# Altium schematic sheet Discharge.SchDoc
size A4
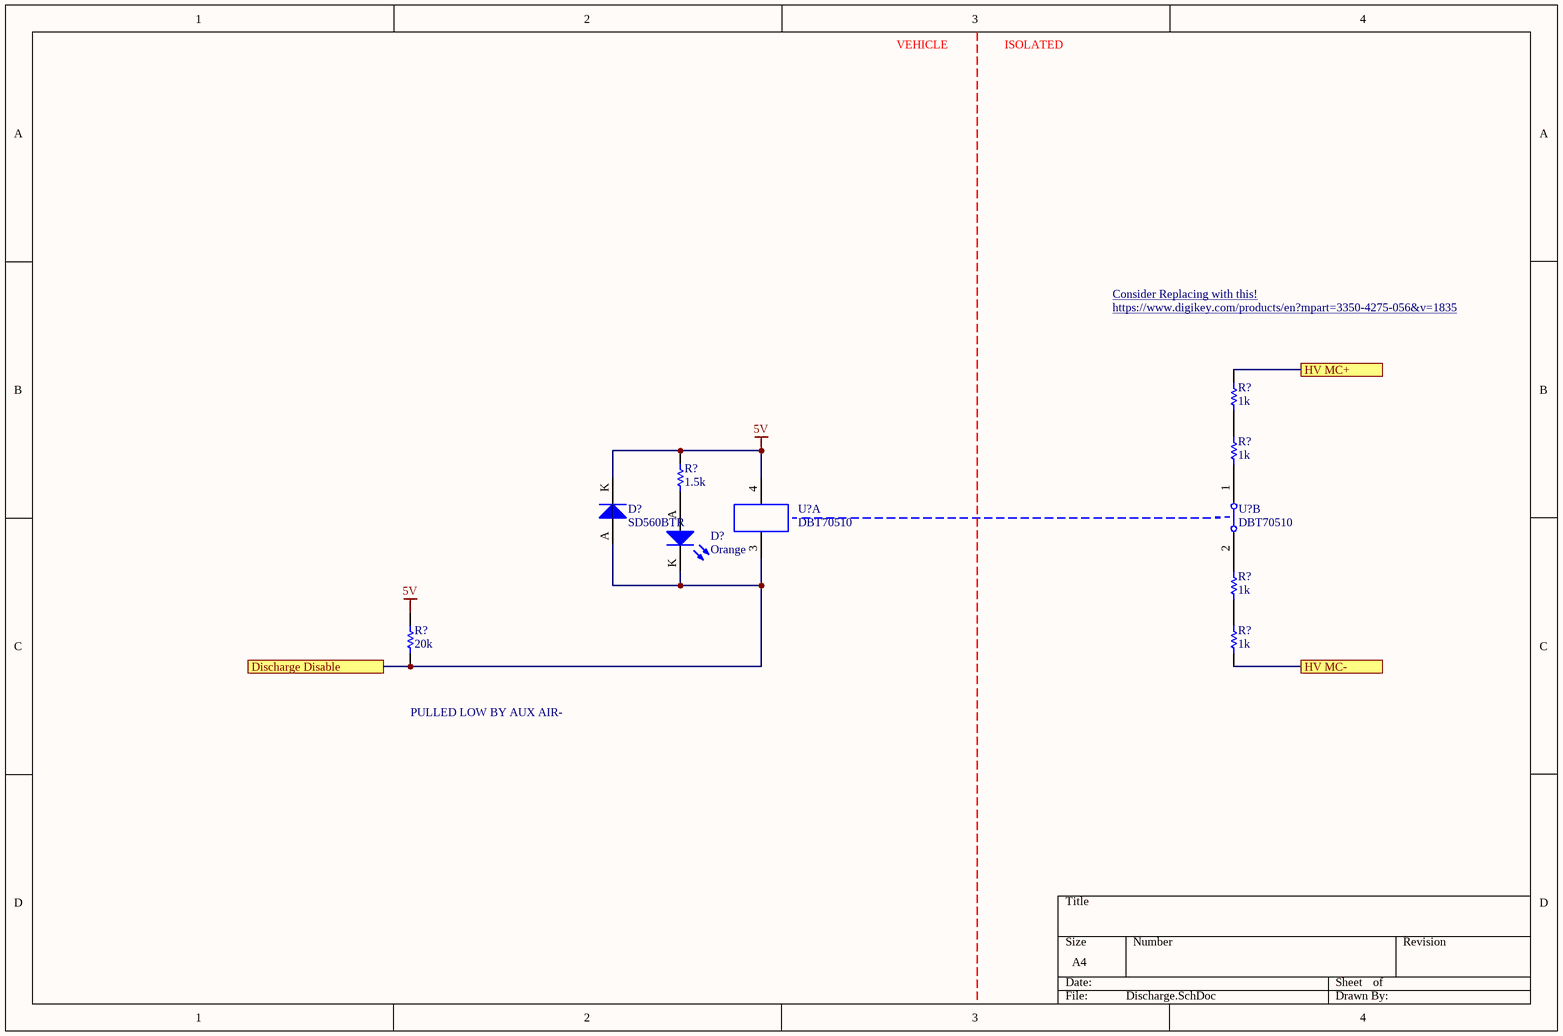
[diagram p0: Discharge.SchDoc]

## Parts
(Parts that share a designator on the sheet are numbered #1, #2 ... from top to bottom, then left to right.)
D?#1  Orange  [0805 LED]
D?#2  SD560BTR  [SMB Diode]
R?#1  1k  [B TO-263]
R?#2  1k  [B TO-263]
R?#3  1.5k  [0805]
R?#4  1k  [B TO-263]
R?#5  20k  [0805]
R?#6  1k  [B TO-263]
U?#1  DBT70510  [C3 SPST]  (part A of 2)
U?#2  DBT70510  [C3 SPST]  (part B of 2)

## Ports
Discharge Disable, HV MC+, HV MC-

## Nets
5V: D?#2.K R?#3.2 R?#5.2 U?#1.4
Discharge Disable: D?#1.K D?#2.A R?#5.1 U?#1.3 ; port Discharge Disable
HV MC+: R?#1.2 ; port HV MC+
HV MC-: R?#6.1 ; port HV MC-
NetD?#1_A: D?#1.A R?#3.1
NetR?#1_1: R?#1.1 R?#2.2
NetR?#4_1: R?#4.1 R?#6.2
NetR?#4_2: R?#4.2 U?#2.2

Not connected (* = marked no-connect by the designer): R?#2 1; U?#2 1

## Notes on the sheet
- VEHICLE
- ISOLATED
- https://www.digikey.com/products/en?mpart=3350-4275-056&v=1835
- Consider Replacing with this! <https://www.digikey.com/products/en?mpart=3350-4275-056&v=1835>
- PULLED LOW BY AUX AIR-

## Library data of the parts
D?#1 = SML-211DTT86: Orange LED Indication - Discrete 1.75V 0805 (2012 Metric); Manufacturer: ROHM Semiconductor; Part Number: SML-211DTT86; Colour: Orange; Digikey Part Number: 511-1291-1-ND; Digikey Link: https://www.digikey.com/product-detail/en/rohm-semiconductor/SML-211DTT86/511-1291-1-ND/637104
D?#2 = SD560BTR: 1.2V_F 600V 5A SMB; Manufacturer: SMC Diode Solutions; Part Number: SD560BTR; Digikey Part Number: 1655-1530-2-ND; Digikey Link: https://www.digikey.com/product-detail/en/smc-diode-solutions/SD560BTR/1655-1530-2-ND/6022620
R?#1 R?#2 R?#4 R?#6 = PWR263S-35-1001J: Manufacturer: Bournes Inc; Tolerance: 0.05; Rated Voltage: 35W; Part Number: PWR263S-35-1001J; Value: 1k; Digikey Part Number: PWR263S-35-1001J-ND
R?#3 = RC0805FR071K5L: Manufacturer: YAGEO; Tolerance: 0.01; Rated Voltage: 0.125W; Part Number: RC0805FR071K5L; Value: 1.5k; Material: FR-07
R?#5 = RC0805FR0720KL: Manufacturer: YAGEO; Tolerance: 0.01; Rated Voltage: 0.125W; Part Number: RC0805FR0720KL; Value: 20k; Material: FR-07
U?#1 U?#2 = DBT70510: RELAY REED SPST-NC 2A 5V; Manufacturer: Cynergy 3; Part Number: DBT70510; Digikey Part Number: 725-1038-ND; Digikey Link: https://www.digikey.com/product-detail/en/cynergy-3/DBT70510/725-1038-ND/752033